# EAGLE design CEE-devboard (EAGLE 5.07)
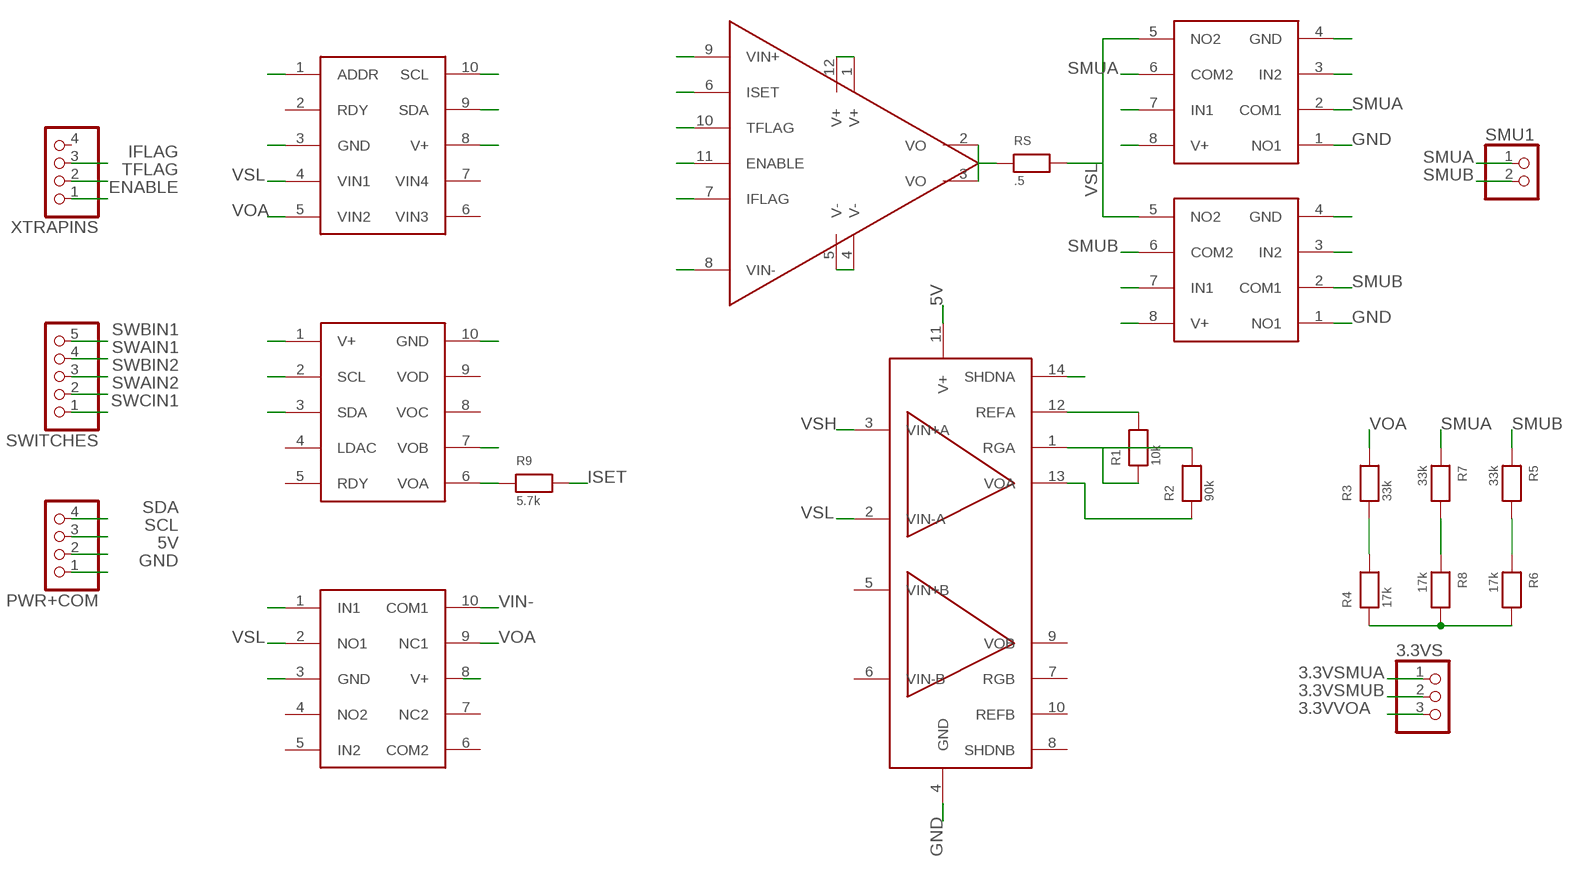
[diagram p0: schematic, sheet 1]

## Parts
3.3VS  HEADER-1X3ROUND  [1X03_ROUND]
ADC  ADS1015  [MSOP10]
DAC  MCP4728  [MSOP10]
INSA  INA2332  INA2332INA2332  [TSSOP14]
OPA  OPA567  [QFN12]
PWR+COM  HEADER-1X4ROUND  [1X04_ROUND]
R1  10k  RESISTOR0805  [0805]
R2  90k  RESISTOR0805  [0805]
R3  33k  RESISTOR0805  [0805]
R4  17k  RESISTOR0805  [0805]
R5  33k  RESISTOR0805  [0805]
R6  17k  RESISTOR0805  [0805]
R7  33k  RESISTOR0805  [0805]
R8  17k  RESISTOR0805  [0805]
R9  5.7k  RESISTOR0805  [0805]
RS  .5  RESISTOR2512  [2512]
SMU1  HEADER-1X2ROUND  [1X02_ROUND]
SWA  TS5A21366  TS5A21366TS5A21366  [DCU8]
SWB  TS5A21366  TS5A21366TS5A21366  [DCU8]
SWC  TS5A23157  TS5A23157DGSR  [MSOP10]
SWITCHES  HEADER-1X5ROUND  [1X05_ROUND]
XTRAPINS  HEADER-1X4ROUND  [1X04_ROUND]

## Nets
3.3VSMUA: 3.3VS.1 R7.2 R8.1
3.3VSMUB: 3.3VS.2 R5.2 R6.1
3.3VVOA: 3.3VS.3 R3.1 R4.2
5V: ADC.8(V+) DAC.1(V+) INSA.11(V+) INSA.14(SHDNA) OPA.1(V+) OPA.12(V+) PWR+COM.2 SWA.8(V+) SWB.8(V+) SWC.8(V+)
ENABLE: OPA.11(ENABLE) XTRAPINS.1
GND: ADC.1(ADDR) ADC.3(GND) DAC.10(GND) INSA.4(GND) OPA.4(V-) OPA.5(V-) PWR+COM.1 R4.1 R6.2 R8.2 SWA.1(NO1) SWA.4(GND) SWB.1(NO1) SWB.4(GND) SWC.3(GND)
IFLAG: OPA.7(IFLAG) XTRAPINS.3
ISET: OPA.6(ISET) R9.2
N$1: DAC.6(VOA) R9.1
REFA: INSA.12(REFA) R1.2
RGA: INSA.1(RGA) R1.1 R2.2
SCL: ADC.10(SCL) DAC.2(SCL) PWR+COM.3
SDA: ADC.9(SDA) DAC.3(SDA) PWR+COM.4
SMUA: R7.1 SMU1.1 SWA.2(COM1) SWA.6(COM2)
SMUB: R5.1 SMU1.2 SWB.2(COM1) SWB.6(COM2)
SWAIN1: SWA.7(IN1) SWITCHES.4
SWAIN2: SWA.3(IN2) SWITCHES.2
SWBIN1: SWB.7(IN1) SWITCHES.5
SWBIN2: SWB.3(IN2) SWITCHES.3
SWCIN1: SWC.1(IN1) SWITCHES.1
TFLAG: OPA.10(TFLAG) XTRAPINS.2
VIN+: DAC.7(VOB) OPA.9(VIN+)
VIN-: OPA.8(VIN-) SWC.10(COM1)
VOA: ADC.5(VIN2) INSA.13(VOA) R2.1 R3.2 SWC.9(NC1)
VSH: INSA.3(VIN+A) OPA.2(VO) OPA.3(VO) RS.1
VSL: ADC.4(VIN1) INSA.2(VIN-A) RS.2 SWA.5(NO2) SWB.5(NO2) SWC.2(NO1)
Unconnected: ADC.2(RDY) ADC.6(VIN3) ADC.7(VIN4) DAC.4(LDAC) DAC.5(RDY) DAC.8(VOC) DAC.9(VOD) INSA.5(VIN+B) INSA.6(VIN-B) INSA.7(RGB) INSA.8(SHDNB) INSA.9(VOB) INSA.10(REFB) SWC.4(NO2) SWC.5(IN2) SWC.6(COM2) SWC.7(NC2) XTRAPINS.4

## Library data of the parts
3.3VS = nonolith:HEADER-1X3: PIN HEADER
ADC = nonolith:ADS1015: 12b I2C ADC: ADS1015
DAC = nonolith:MCP4728: 12b I2C DAC: MCP4728
INSA = nonolith:INA2332: INSAMP - 5x: INA2332
OPA = nonolith:OPA567: OPA567: 2a RRIO CMOS OPA / QFN12
PWR+COM XTRAPINS = nonolith:HEADER-1X4: PIN HEADER
R1-R9 RS = nonolith:RESISTOR: Resistors 0402 - 0402 Surface Mount Package 10.0K 1% 1/16W [Digikey: 311-10.0KLRTR-ND] 0603 - 0603 Surface Mount Package 0 Ohm 1/10 Watt 1% Resistor 15 Ohm 1/10 Watt 1% Resistor 33 Ohm 1/10 Watt 1% Resistor 49.9 Ohm 1/10 Watt 1% Resistor 100 Ohm 1/10 Watt 1% Resistor 150 Ohm 1/10 Watt 1% Resistor 240 Ohm 1/10 Watt 1% Resistor 390 Ohm 1/10 Watt 1% Resistor 560 Ohm 1/10 Watt 1% Resistor 750 Ohm 1/10 Watt 1% Resistor 1.0K Ohm 1/10 Watt 1% Resistor 1.5K Ohm 1/10 Watt 1% Resistor 2.0K Ohm 1/10 Watt 1% Resistor 4.7K Ohm 1/10 Watt 1% Resistor 10.0K Ohm 1/10 Watt 1% Resistor 20.0K Ohm 1/10 Watt 1% Resistor 33.0K Ohm 1/10 Watt 1% Resistor 100.0K Ohm 1/10 Watt 1% Resistor 0805 - 0805 Surface Mount Package 0 Ohm 1/8 Watt 1% Resistor 33 Ohm 1/8 Watt 1% Resistor 100 Ohm 1/8 Watt 1% Resistor 150 Ohm 1/8 Watt 1% Resistor 200 Ohm 1/8 Watt 1% Resistor 240 Ohm 1/8 Watt 1% Resistor 330 Ohm 1/8 Watt 1% Resistor 390 Ohm 1/8 Watt 1% Resistor 470 Ohm 1/8 Watt 1% Resistor 1.0K Ohm 1/8 Watt 1% Resistor 1.5K Ohm 1/8 Watt 1% Resistor 2.0K Ohm 1/8 Watt 1% Resistor 4.7K Ohm 1/8 Watt 1% Resistor 5.1K Ohm 1/8 Watt 1% Resistor 5.6K Ohm 1/8 Watt 1% Resistor 10.0K Ohm 1/8 Watt 1% Resistor 22.0K Ohm 1/8 Watt 1% Resistor 33.0K Ohm 1/8 Watt 1% Resistor 100K Ohm 1/8 Watt 1% Resistor 1206 - 1206 Surface Mount Package
SMU1 = nonolith:HEADER-1X2: PIN HEADER
SWA SWB = nonolith:TS5A21366: 200ma digitally controlled switch: TS5A21366
SWC = nonolith:TS5A23157DGSR: DUAL SPDT SWITCH: TS5A23157DGSR
SWITCHES = nonolith:HEADER-1X5: PIN HEADER

## Net classes
0 default: width 0.254 mm

## Board
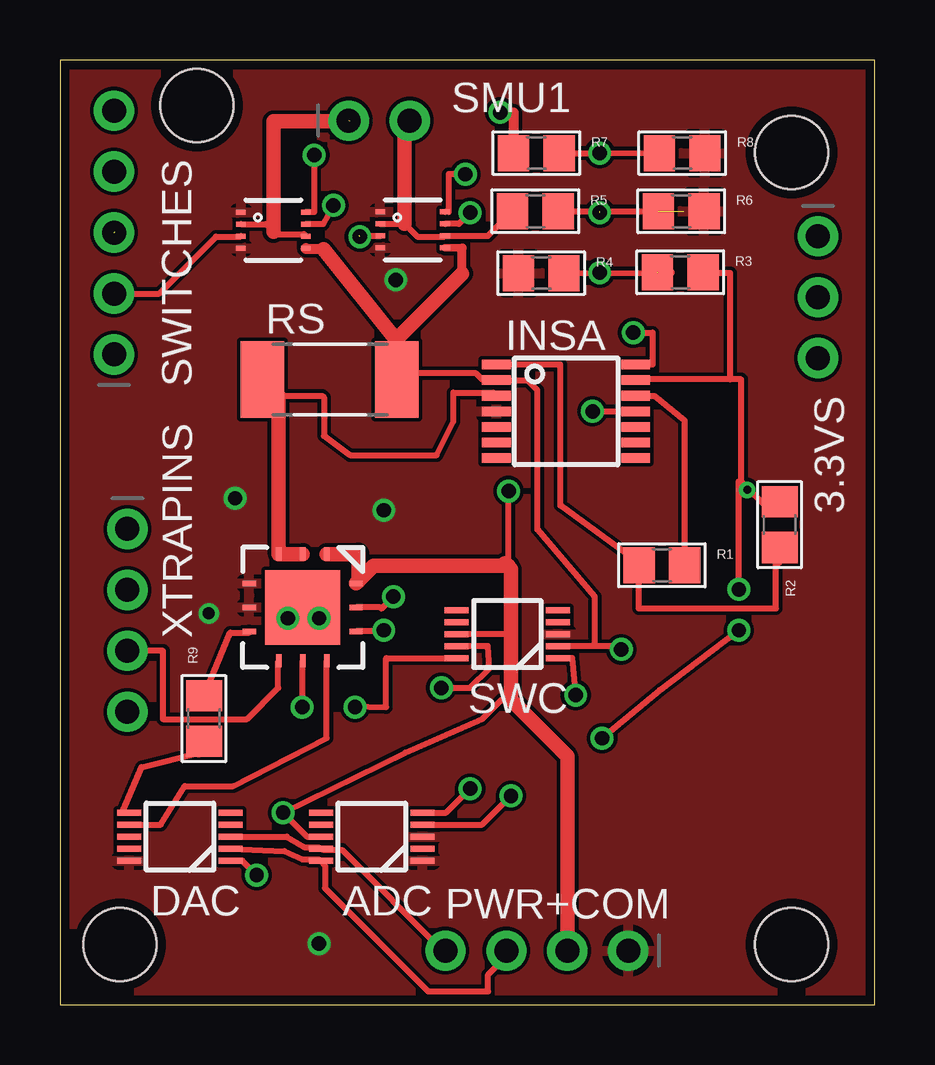
[diagram p1: board, top side]
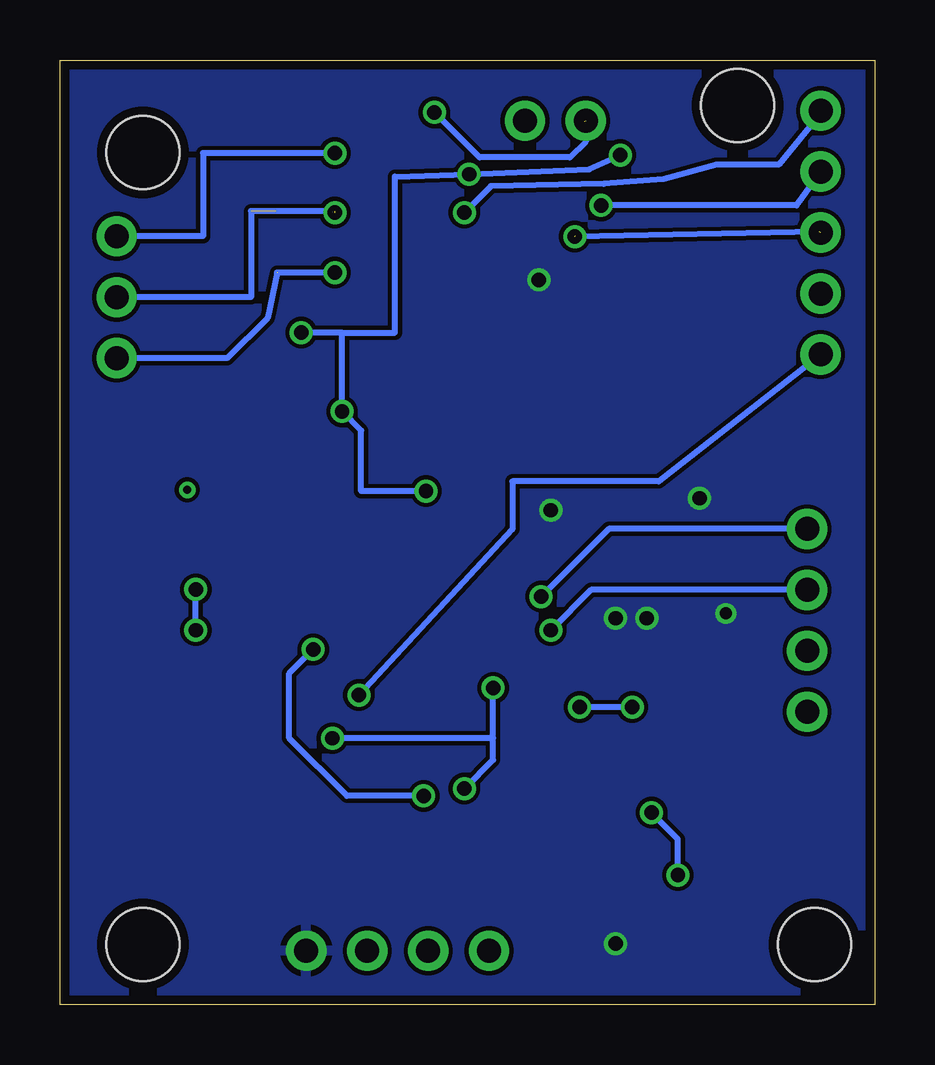
[diagram p2: board, bottom side, seen from below]

Size 33.96 x 39.36 mm. Coordinates in mm from the lower left corner, seen from the top.
Outline: 0,0 33.96,0 33.96,39.36 0,39.36 0,0
Copper layers (1*16): Top 0.0356mm / dielectric 1.5011mm / Bottom 0.0356mm
Design rules "LaenPCBOrder": minimum track width 6mil, minimum drill 13mil, track to track 6mil, track to pad 6mil, pad to pad 6mil, via to via 6mil, smd to smd 6mil, copper to edge 15mil, drill to drill 6mil, minimum pad ring 7mil, minimum via ring 7mil, stop-mask expansion 4mil, vias tented up to drill 0mil, thermal gap 10mil
Holes 3.05 mm at 30.5,35.5 30.5,2.5 2.5,2.5 5.71,37.47

### Footprints (pad centres in the part's own frame; a part is rotated, then mirrored left to right if it is on the bottom)
1X03_ROUND = drill 1 pad 1.676 round: 1 -2.54,0; 2 0,0; 3 2.54,0
MSOP10 = smd 0.25 x 1: 1 -1,-2.113; 2 -0.5,-2.113; 3 0,-2.113; 4 0.5,-2.113; 5 1,-2.113; 6 1,2.113; 7 0.5,2.113; 8 0,2.113; 9 -0.5,2.113; 10 -1,2.113
TSSOP14 = smd 0.4 x 1.2: 1 -1.95,-2.9; 2 -1.3,-2.9; 3 -0.65,-2.9; 4 0,-2.9; 5 0.65,-2.9; 6 1.3,-2.9; 7 1.95,-2.9; 8 1.95,2.9; 9 1.3,2.9; 10 0.65,2.9; 11 0,2.9; 12 -0.65,2.9; 13 -1.3,2.9; 14 -1.95,2.9
QFN12 = smd 0.55 x 0.24: 1 0.275,3.5; 2 0.275,2.5; 3 0.275,1.5; 7 4.725,1.5; 8 4.725,2.5; 9 4.725,3.5 | smd 0.24 x 0.55: 4 1.5,0.275; 5 2.5,0.275; 6 3.5,0.275; 10 3.5,4.725; 11 2.5,4.725; 12 1.5,4.725 | smd 3.12 x 3.12: P$1 2.5,2.5
1X04_ROUND = drill 1 pad 1.676 round: 1 -3.81,0; 2 -1.27,0; 3 1.27,0; 4 3.81,0
0805 = smd 1.3 x 1.5: 1 -0.95,0; 2 0.95,0
2512 = smd 1.8 x 3.2: 1 -2.8,0; 2 2.8,0
1X02_ROUND = drill 1 pad 1.676 round: 1 -1.27,0; 2 1.27,0
DCU8 = smd 0.4 x 0.21: 1 -2.7,1.5; 2 -2.7,1; 3 -2.7,0.5; 4 -2.7,0; 5 0,0; 6 0,0.5; 7 0,1; 8 0,1.5
1X05_ROUND = drill 1 pad 1.676 round: 1 -5.08,0; 2 -2.54,0; 3 0,0; 4 2.54,0; 5 5.08,0

### Placement (x,y rotation side)
3.3VS  31.6,29.48 270 top
ADC  13,7 90 top
DAC  5,7 90 top
INSA  21.1,24.72 270 top
OPA  7.62,19.05 270 top
PWR+COM  19.88,2.25 180 top
R1  25.09,18.31 0 top
R2  30,20 270 top
R3  25.86,30.52 0 top
R4  20.06,30.48 0 top
R5  19.82,33.06 0 top
R6  25.9,33.06 0 top
R7  19.86,35.48 0 top
R8  25.94,35.48 0 top
R9  6,11.92 90 top
RS  11.24,26.05 0 top
SMU1  13.31,36.83 0 top
SWA  10.25,31.52 0 top
SWB  16.05,31.53 0 top
SWC  18.65,15.44 90 top
SWITCHES  2.25,32.17 90 top
XTRAPINS  2.81,16.01 270 top

### Tracks (layer width: path | path; a pad name or v marks a point on that pad's centre or on a via)
3.3VSMUA  (via drill 0.6)
  Top 0.254: R7.2 v22.5,35.48 24.99,35.5
  Top 0.406: 24.99,35.5 R8.1
  Bottom 0.254: 3.3VS.1 28,32.02 28,35.48 v22.5,35.48
3.3VSMUB  (via drill 0.6)  (2 unrouted)
  Top 0.254: R5.2 R6.1
  Bottom 0.254: 3.3VS.2 26,29.48 26,33.06 22.5,33.06
  other vias: 22.5,33
3.3VVOA  (via drill 0.6)  (1 unrouted)
  Top 0.254: R4.2 25.41,30.5
  Top 0.406: 25.41,30.5 R3.1
  Bottom 0.254: 3.3VS.3 27,26.94 25.31,28.6 24.91,30.5 v22.5,30.5 22.5,30.48
5V  (via drill 0.6)
  Top 0.254: ADC.8 10.3,7 v9.3,8 14.4,10.5 17.6,11.9 18.4,12.7 18.8,12.7 | DAC.1 7.6,6 v8.2,5.4 | SWC.8 18.74,15.44 18.8,15.5 | SWA.8 10.6,33.02 v10.6,35.4 | SWB.8 16.2,33.03 16.2,34.6 v16.9,34.6 | INSA.14 24.7,26.67 24.7,28 v23.9,28 | INSA.11 v22.2,24.72 22.1,24.7 22.1,24.4 | 18.7,18.29 v18.7,21.4
  Top 0.61: PWR+COM.2 21.15,10.35 18.8,12.7 18.8,15.5 18.8,18.13 18.54,18.39 18.7,18.29 13.08,18.29 OPA.12 12.45,17.65 12.45,18.8 12.43,18.77 OPA.1
  Bottom 0.254: v8.2,5.4 8.2,6.9 v9.3,8 | 22.2,28 20,28 20,34.5 v16.9,34.6 11.9,34.8 v10.6,35.4 | 22.2,28 v23.9,28 | 22.2,28 v22.2,24.72 21.4,23.92 21.4,21.4 v18.7,21.4
ENABLE  (via drill 0.6)
  Top 0.254: OPA.11 13.35,16.55 13.4,16.5 v13.9,17
  Bottom 0.254: XTRAPINS.1 11.08,19.82 v13.9,17
GND  (via drill 0.5, 0.6)
  other vias: 10.79,2.54 14,30.2 13.5,20.6 10.8,16.1 9.5,16.1 7.3,21.1 6.2,16.3
  pour Top (isolate 0.152): 0,39.5 34,39.5 34,0 0,0
  pour Bottom (isolate 0.178): 0,39.5 34,39.5 34,0 0,0
IFLAG
  Top 0.254: XTRAPINS.3 4.3,14.74 4.3,11.9 7.8,11.9 9.1,13.2 9.1,14.3 OPA.7
ISET
  Top 0.254: R9.2 7.1,15.5 7.89,15.5 OPA.6
N$1
  Top 0.254: DAC.6 2.6,8 3.4,9.9 5.8,10.5
  Top 0.406: 5.8,10.5 R9.1
REFA
  Top 0.254: R1.2 26.05,24.34 24.8,25.35 24,25.35 INSA.12
RGA
  Top 0.254: 29.6,18.65 R2.2 30,18.41 29.84,18.41 29.84,16.51 24.13,16.51 R1.1 | INSA.1 20.86,26.67 20.86,20.8 24.14,18.41
  Top 0.406: R1.1 24.14,18.41
SCL
  Top 0.254: DAC.2 9.35,6.4 10.1,6.05 10.8,6.05 10.85,6 ADC.10 10.95,5.9 11.05,5.8 11.05,4.85 15.35,0.55 17.85,0.55 17.85,1.25 18.6,2 PWR+COM.3
SDA
  Top 0.254: DAC.3 9.45,7 10.2,6.55 10.8,6.55 10.85,6.5 ADC.9 11,6.45 11.75,6.45 15.95,2.25 PWR+COM.4
SMUA  (via drill 0.6)  (1 unrouted)
  Top 0.254: SWA.2 8.58,32.52 8.9,32.2 9,32.1 10.17,32.1 SWA.6
  Top 0.406: v18.35,37.18 18.91,37.18 R7.1
  Top 0.61: 12.1,36.8 8.9,36.8 8.9,32.2
  Bottom 0.254: SMU1.1 12.04,35.96 12.7,35.3 16.47,35.3 v18.35,37.18
  Bottom 0.406: 18.37,37.19 v18.35,37.19 v18.35,37.18
SMUB
  Top 0.254: R5.1 17.84,32.03 SWB.6 16.03,32 14.9,32 14.37,32.53 SWB.2 | 14.37,36.62 SMU1.2
  Top 0.61: 14.37,32.53 14.37,36.62
SWAIN1  (via drill 0.6)
  Top 0.254: SWA.7 10.98,32.52 v11.4,33.3
  Bottom 0.254: v11.4,33.3 3.26,33.3 SWITCHES.4
SWAIN2
  Top 0.254: SWITCHES.2 4.13,29.63 6.5,32 7.52,32 SWA.3
SWBIN1  (via drill 0.6)
  Top 0.254: SWB.7 16.63,32.53 v17.1,33
  Bottom 0.254: SWITCHES.5 2.25,37.15 4,35 6.6,35 8.8,34.4 11.3,34.2 16,34.1 v17.1,33
SWBIN2  (via drill 0.6)  (2 unrouted)
  Top 0.254: 12.47,32.03 SWB.3
  Bottom 0.254: 2.3,32.2 v12.5,32
SWCIN1  (via drill 0.6)
  Top 0.254: SWC.1 21.36,14.44 v21.5,12.9
  Bottom 0.254: v21.5,12.9 15.1,19.8 15.1,21.8 9,21.8 2.3,27.04 SWITCHES.1
TFLAG  (via drill 0.6)
  Top 0.254: OPA.10 13.45,15.55 v13.5,15.6
  Bottom 0.254: XTRAPINS.2 11.82,17.28 v13.5,15.6
VIN+
  Top 0.254: OPA.9 11.12,11.1 7.22,9.1 5.2,9.1 4.2,7.5 DAC.7
VIN-  (via drill 0.6)
  Top 0.254: OPA.8 10.12,12.82 v10.1,12.4 | SWC.10 13.6,14.44 13.6,12.4 12.14,12.44 v12.3,12.4
  Bottom 0.254: v10.1,12.4 v12.3,12.4
VOA  (via drill 0.33, 0.6)
  Top 0.254: 27.94,26.05 28.4,26.05 28.4,21.8 | 28.7,21.5 29.6,20.6 30,20.6 R2.1 | 28.4,21.8 28.7,21.5 | INSA.13 24,26.05 27.94,26.05 | 28.7,21.5 v28.65,21.45 | 27.94,26.05 27.94,30.48 26.81,30.48 | ADC.5 16.1,8 v17.1,9 | v22.6,11.1 25,13.1 v28.3,15.6 | v28.3,17.3 28.3,21.8 28.4,21.8 | v15.9,13.2 17.1,13.2 17.9,14 17.84,14.94 SWC.9
  Top 0.406: 26.81,30.48 R3.2
  Bottom 0.254: 15.9,11.1 15.9,10.2 v17.1,9 | 15.9,11.1 v15.9,13.2 | 15.9,11.1 v22.6,11.1 | v28.3,15.6 v28.3,17.3
VSH
  Top 0.254: RS.1 | 9.12,25.37 10.93,25.37 11,25.3 11,23.7 12.1,22.9 15.7,22.9 16.4,24.3 16.4,25.5 18.07,25.5 INSA.3
  Top 0.61: OPA.2 OPA.3 9.12,25.37 RS.1
VSL  (via drill 0.6)
  Top 0.254: 14,27.7 14,26.05 RS.2 | RS.2 14.1,26.3 17.35,26.3 17.6,26.05 18.2,26.05 INSA.2 18.22,26 19.5,26 19.9,25.6 19.9,19.8 22.3,17 22.3,14.94 | ADC.4 17.6,7.5 v18.8,8.7 | 22.3,14.94 23.26,14.94 v23.4,14.8 | 22.3,14.94 SWC.2 | RS.2 14.6,26.2
  Top 0.317: 16.76,31.53 SWB.5
  Top 0.381: 16.76,30.46 16.76,31.53
  Top 0.406: SWA.5 10.25,31.48 10.98,31.48
  Top 0.61: 10.98,31.48 14,27.7 16.76,30.46
  Bottom 0.254: v18.8,8.7 22,8.7 24.4,11.1 24.4,13.8 v23.4,14.8